# Altium project IEEEBOT_V1I1.PrjPcb (part 1 of 2)
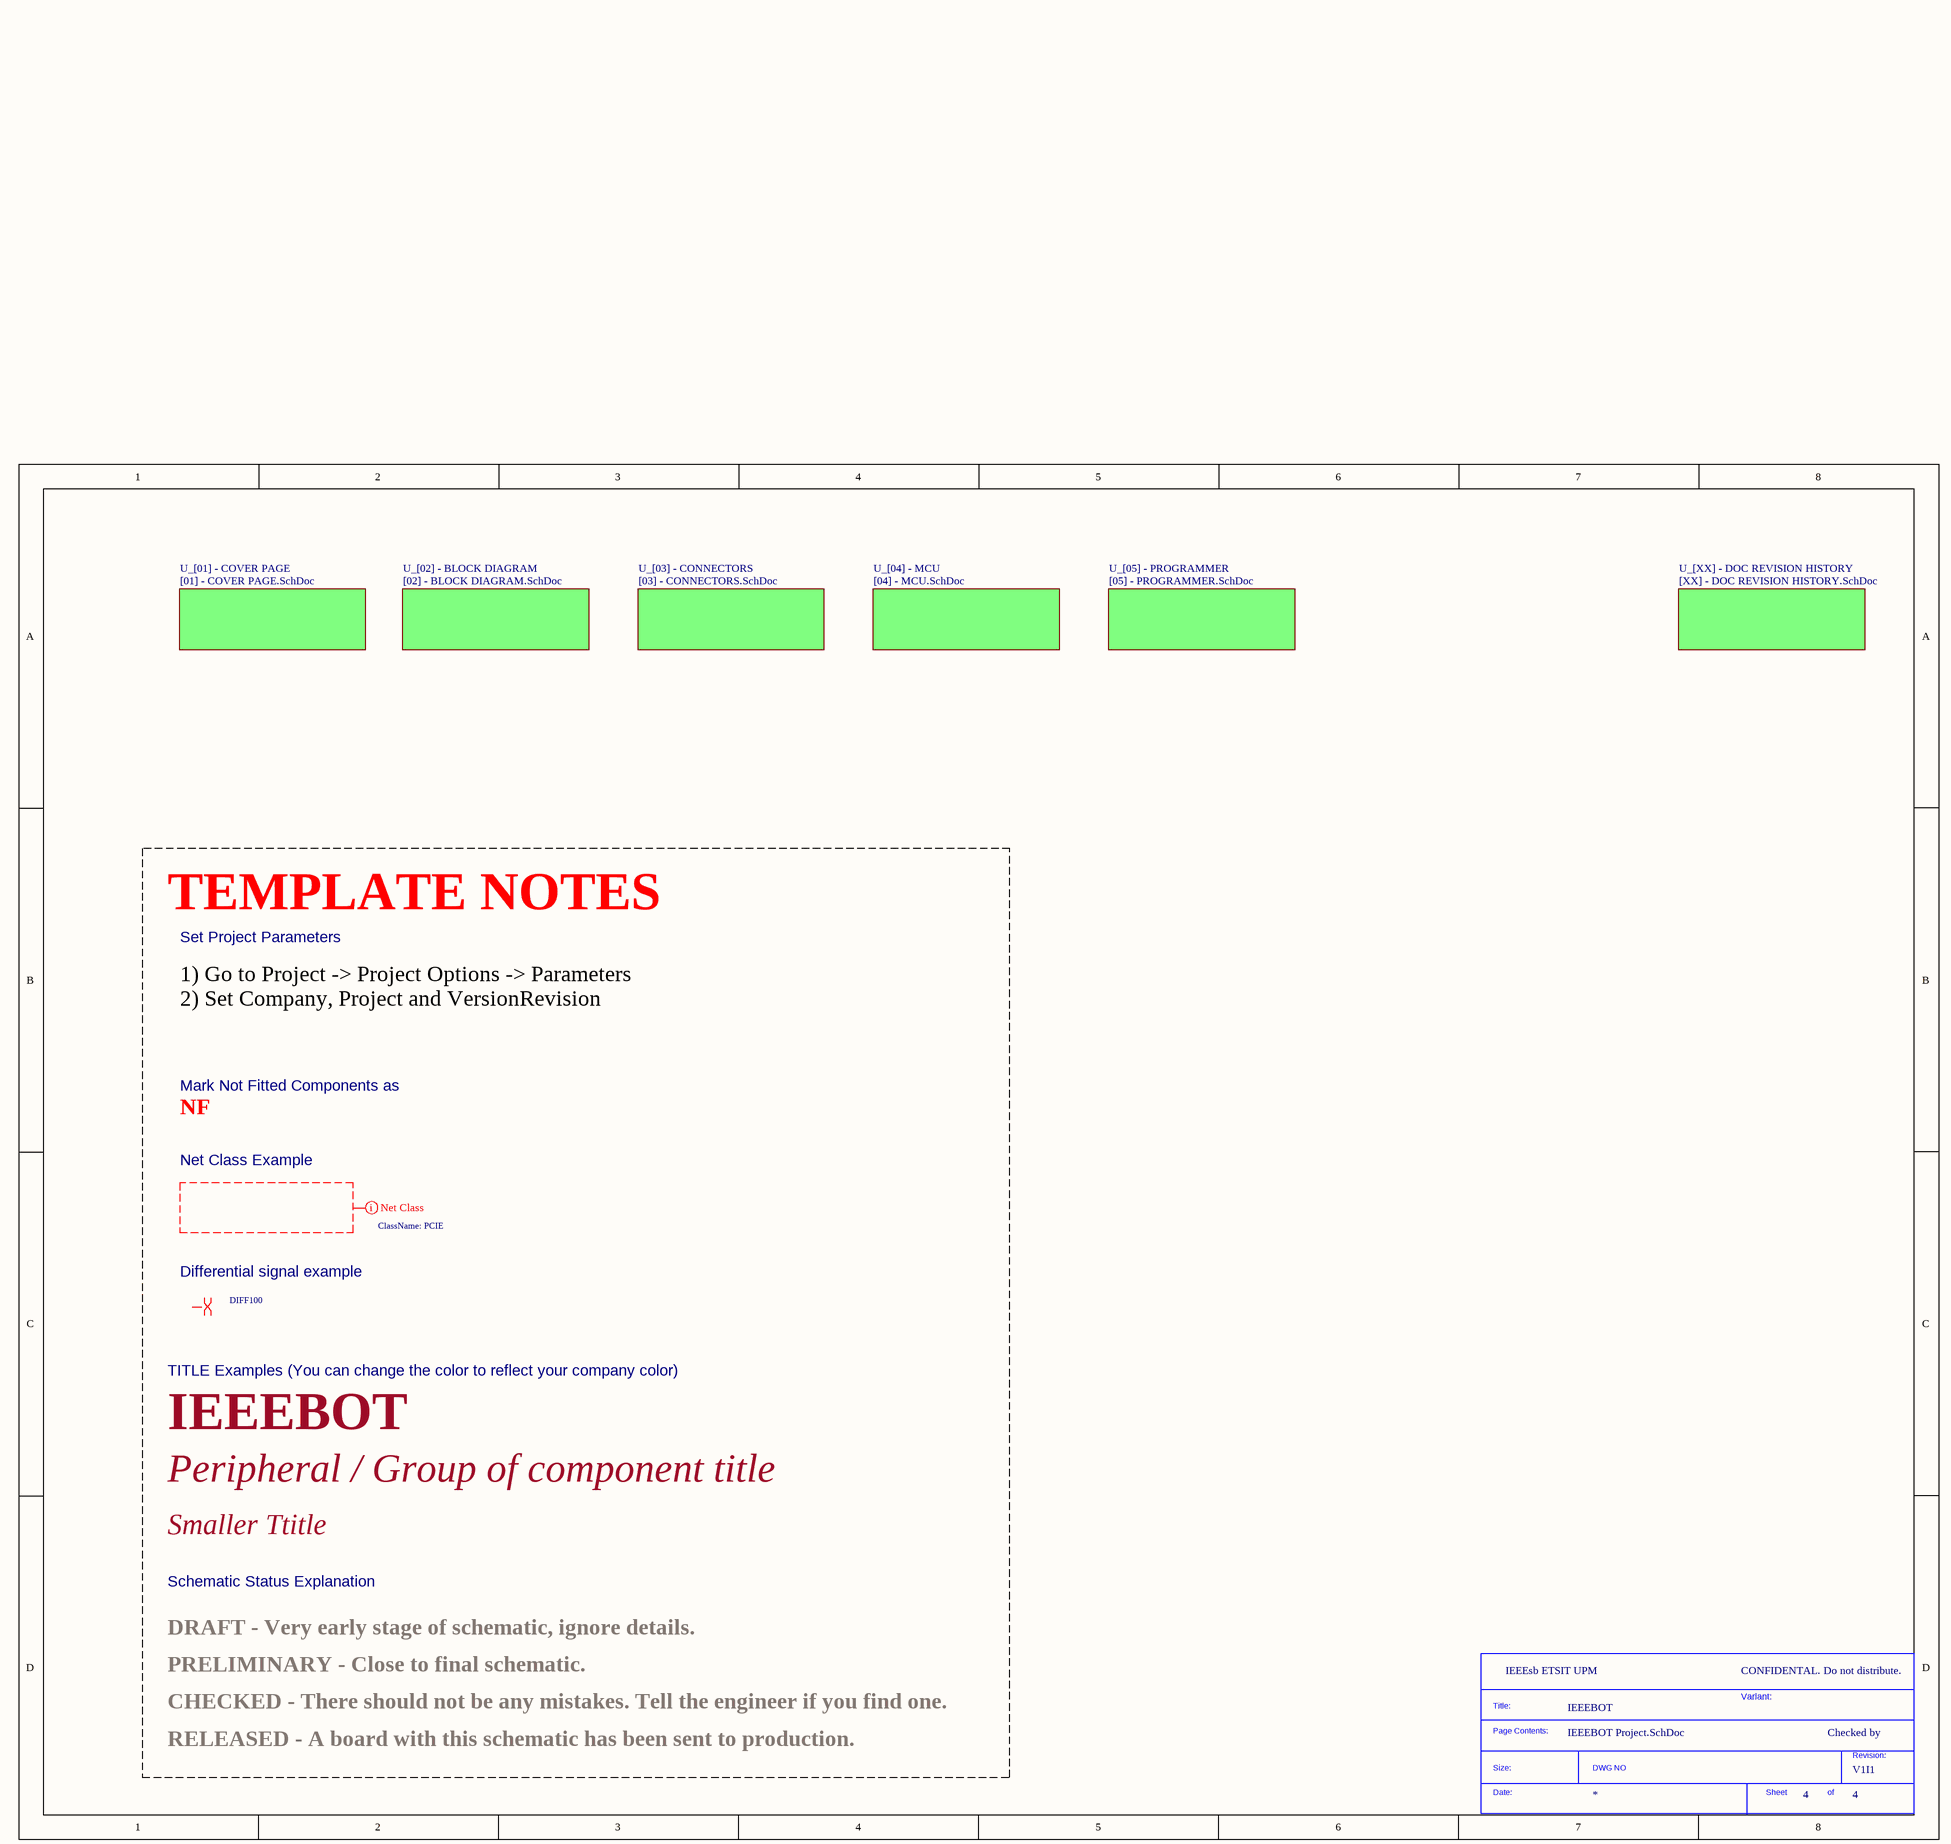
[diagram p0: IEEEBOT Project.SchDoc]
Company: IEEEsb ETSIT UPM; Project: IEEEBOT; VersionRevision: V1I1
4 sheets, 76 parts. Net scope: flat (ports and power ports of the same name join across sheets).
Board file: IEEEBOT_PCB_V1I1.PcbDoc
Sheets:
  IEEEBOT Project.SchDoc
    U_[04] - MCU = [04] - MCU.SchDoc
    U_[05] - PROGRAMMER = [05] - PROGRAMMER.SchDoc
    U_[03] - CONNECTORS = [03] - CONNECTORS.SchDoc

## Sheet IEEEBOT Project.SchDoc
size A3; CompanyName: KDS; Organization: KDS; DocumentNumber: 4; Revision: V1I1; SheetNumber: 4; SheetTotal: 4; PageSetup: Record=PageOptions|CenterHorizontal=True|CenterVertical=True|PrintScale=1.07|XCorrection=1.00|YCorrection=1.00|PrintKind=1|BorderSize=5000000|LeftOffset=0|BottomOffset=0|Orientation=2|PaperLength=1000|PaperWidth=1000|Scale=100|PaperSource=7|PrintQuality=600|MediaType=1|DitherType=10|PaperKind=A3|PrintScaleMode=1; ProjectName: KDS C6A816x Module

### Parts
*  SDTitleBlock  (value not drawn)  (graphical)

### Sub-sheets
U_[01] - COVER PAGE = [01] - COVER PAGE.SchDoc (file not in this document): no entries
U_[02] - BLOCK DIAGRAM = [02] - BLOCK DIAGRAM.SchDoc (file not in this document): no entries
U_[03] - CONNECTORS = [03] - CONNECTORS.SchDoc: no entries
U_[04] - MCU = [04] - MCU.SchDoc: no entries
U_[05] - PROGRAMMER = [05] - PROGRAMMER.SchDoc: no entries
U_[XX] - DOC REVISION HISTORY = [XX] - DOC REVISION HISTORY.SchDoc (file not in this document): no entries

### Layout directives
net class PCIE: (no net found under the mark)
differential pair; net class DIFF100: (no net found under the mark)

### Notes on the sheet
- TEMPLATE NOTES
- Set Project Parameters
- 1) Go to Project -> Project Options -> Parameters
  2) Set Company, Project and VersionRevision
- NF
- Mark Not Fitted Components as
- Net Class Example
- Differential signal example
- TITLE Examples (You can change the color to reflect your company color)
- IEEEBOT
- Peripheral / Group of component title
- Smaller Ttitle
- Schematic Status Explanation
- PRELIMINARY - Close to final schematic.
- DRAFT - Very early stage of schematic, ignore details.
- CONFIDENTAL. Do not distribute.
- CHECKED - There should not be any mistakes. Tell the engineer if you find one.
- Variant:
- Checked by
- RELEASED - A board with this schematic has been sent to production.
- (in symbol SDTitleBlock) Title:; Page Contents:; Revision:; Size:; DWG NO; Date:; Sheet; of

## Sheet [04] - MCU.SchDoc
size A4
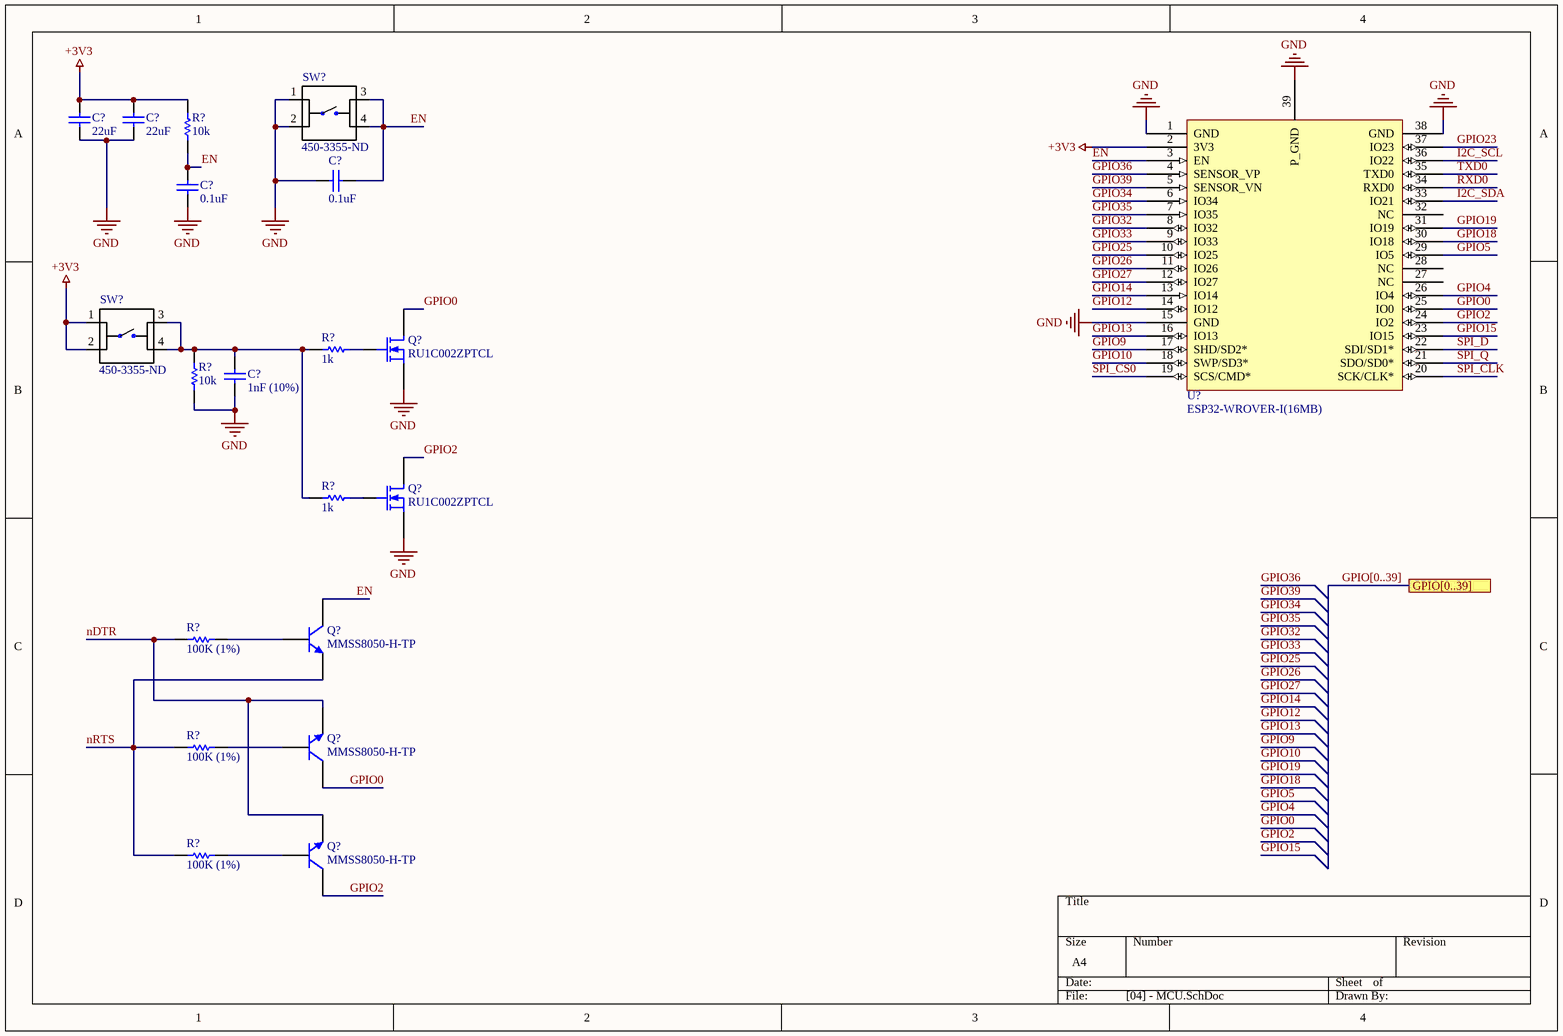
[diagram p1: [04] - MCU.SchDoc]

### Parts
(Parts that share a designator on the sheet are numbered #1, #2 ... from top to bottom, then left to right.)
C?#1  22uF
C?#2  22uF
C?#3  0.1uF
C?#4  0.1uF
C?#5  1nF (10%)
Q?#1  RU1C002ZPTCL
Q?#2  RU1C002ZPTCL
Q?#3  MMSS8050-H-TP
Q?#4  MMSS8050-H-TP
Q?#5  MMSS8050-H-TP
R?#1  10k
R?#2  1k
R?#3  10k
R?#4  1k
R?#5  100K (1%)
R?#6  100K (1%)
R?#7  100K (1%)
SW?#1  Supplier Part Number 1: 450-3355-ND  [*SW_SMD_2-1437565-8_4_4.50_6.00_6.00_5.00]  (hidden comment: 2-1437565-8)
SW?#2  Supplier Part Number 1: 450-3355-ND  [*SW_SMD_2-1437565-8_4_4.50_6.00_6.00_5.00]  (hidden comment: 2-1437565-8)
U?#1  ESP32-WROVER-I(16MB)

### Ports
GPIO[0..39]

### Nets
+3V3: C?#1.2 C?#2.2 R?#1.2 SW?#2.1 SW?#2.2 U?#1.2(3V3)
GND: C?#1.1 C?#2.1 C?#3.1 C?#4.2 C?#5.1 Q?#1.3(S) Q?#2.3(S) R?#3.1 SW?#1.1 SW?#1.2 U?#1.1(GND) U?#1.15(GND) U?#1.38(GND) U?#1.39(P_GND)
EN: C?#3.2 C?#4.1 Q?#3.1(C) R?#1.1 SW?#1.3 SW?#1.4 U?#1.3(EN)
GPIO0: Q?#1.1(D) Q?#4.1(C) U?#1.25(IO0)
GPIO2: Q?#2.1(D) Q?#5.1(C) U?#1.24(IO2)
GPIO4: U?#1.26(IO4)
GPIO5: U?#1.29(IO5)
GPIO9: U?#1.17(SHD/SD2*)
GPIO10: U?#1.18(SWP/SD3*)
GPIO12: U?#1.14(IO12)
GPIO13: U?#1.16(IO13)
GPIO14: U?#1.13(IO14)
GPIO15: U?#1.23(IO15)
GPIO18: U?#1.30(IO18)
GPIO19: U?#1.31(IO19)
GPIO23: U?#1.37(IO23)
GPIO25: U?#1.10(IO25)
GPIO26: U?#1.11(IO26)
GPIO27: U?#1.12(IO27)
GPIO32: U?#1.8(IO32)
GPIO33: U?#1.9(IO33)
GPIO34: U?#1.6(IO34)
GPIO35: U?#1.7(IO35)
GPIO36: U?#1.4(SENSOR_VP)
GPIO39: U?#1.5(SENSOR_VN)
I2C_SCL: U?#1.36(IO22)
I2C_SDA: U?#1.33(IO21)
nDTR: Q?#4.3(E) Q?#5.3(E) R?#5.1
nRTS: Q?#3.3(E) R?#6.1 R?#7.1
RXD0: U?#1.34(RXD0)
SPI_CLK: U?#1.20(SCK/CLK*)
SPI_CS0: U?#1.19(SCS/CMD*)
SPI_D: U?#1.22(SDI/SD1*)
SPI_Q: U?#1.21(SDO/SD0*)
TXD0: U?#1.35(TXD0)
NetC?#5_2: C?#5.2 R?#2.1 R?#3.2 R?#4.1 SW?#2.3 SW?#2.4
NetQ?#1_2: Q?#1.2(G) R?#2.2
NetQ?#2_2: Q?#2.2(G) R?#4.2
NetQ?#3_2: Q?#3.2(B) R?#5.2
NetQ?#4_2: Q?#4.2(B) R?#6.2
NetQ?#5_2: Q?#5.2(B) R?#7.2

Not connected (* = marked no-connect by the designer): U?#1 27(NC) 28(NC) 32(NC)

### Buses and harness runs
bus GPIO[0..39] = port GPIO[0..39]

### Library data of the parts
C?#1 C?#2 = CL21A226KQCLRNC: CAP CER 22UF 6.3V X5R 0805; Manufacturer: Samsung; Tolerance: 10%; Supplier 1: Digi-Key; Manufacturer Part Number: CL21A226KQCLRNC; Stock 1: 975518; RoHS: Yes; Mount: Surface Mount; Case/Package: 0805; Case Code (Metric): 2012; Case Code (Imperial): 0805; Min Operating Temperature: -55°C; Max Operating Temperature: 85°C; Packaging: Tape and Reel; Capacitance: 22uF; Voltage Rating: 6.3V; Length: 0.079inch; Width: 0.049inch; Thickness: 0.037inch; ComponentLink1URL: http://www.samsungsem.com/kr/support/product-search/mlcc/CL21A226KQCLRNC.jsp?src-supplier=Digi-Key; ComponentLink1Description: http://www.samsungsem.com/kr/support/product-search/mlcc/CL21A226KQCLRNC.jsp?src-supplier=Digi-Key; Supplier Part Number 1: 1276-6687-1-ND
C?#3 C?#4 = CL21B104KACNNNC: Cap Ceramic 0.1uF 25V X7R 10% SMD 0805 125C Paper T/R; Manufacturer: Samsung; Capacitance: 100nF; Supplier 1: Digi-Key; Manufacturer Part Number: CL21B104KACNNNC; Stock 1: 319136; RoHS: Yes; Mount: Surface Mount; Case/Package: 0805; Contact Plating: Tin; Case Code (Metric): 2012; Case Code (Imperial): 0805; Min Operating Temperature: -55°C; Max Operating Temperature: 125°C; Package Quantity: 1; Packaging: Tape and Reel; Voltage Rating: 25V; Tolerance: 10%; Dielectric: X7R; Voltage: 25V; Length: 2mm; Height: 0.85mm; Width: 0.049inch; Thickness: 0.037inch; Depth: 1.25mm; Radiation Hardening: No; ComponentLink1URL: https://datasheet.ciiva.com/25801/cl21b104kacnnnc-25801824.pdf?src-supplier=Digi-Key; ComponentLink1Description: https://datasheet.ciiva.com/25801/cl21b104kacnnnc-25801824.pdf?src-supplier=Digi-Key; ComponentLink2URL: https://datasheet.ciiva.com/15216/getdatasheetpartid-355204-15216236.pdf?src-supplier=Verical; ComponentLink2Description: https://datasheet.ciiva.com/15216/getdatasheetpartid-355204-15216236.pdf?src-supplier=Verical; Supplier Part Number 1: 1276-1099-1-ND
C?#5 = CL21B102KBANFNC: Cap Ceramic 0.001uF 50V X7R 10% SMD 0805 125°C Paper T/R; Manufacturer: Samsung; Supplier 1: Digi-Key; Manufacturer Part Number: CL21B102KBANFNC; Stock 1: 199889; Pricing 1: 1 = 0,10000, 10 = 0,05000, 100 = 0,02210, 500 = 0,01576, 1000 = 0,01238 (USD); Mount: Surface Mount; Case/Package: 0805; Case Code (Metric): 2012; Case Code (Imperial): 0805; Contact Plating: Tin; Min Operating Temperature: -55°C; Max Operating Temperature: 125°C; Capacitance: 1nF; Tolerance: 10%; Package Quantity: 1; Packaging: Tape and Reel; Voltage Rating: 50V; Dielectric: X7R; Length: 0.079inch; Height: 0.65mm; Width: 0.049inch; Thickness: 0.03inch; Depth: 1.25mm; Radiation Hardening: No; ComponentLink1URL: https://datasheet.ciiva.com/25780/cl21b102kbanfnc-25780808.pdf?src-supplier=Digi-Key; ComponentLink1Description: https://datasheet.ciiva.com/25780/cl21b102kbanfnc-25780808.pdf?src-supplier=Digi-Key; Supplier Part Number 1: 1276-2424-1-ND
Q?#1 Q?#2 = RU1C002ZPTCL: RU1C002ZP Series 20 V 200 mA 1.2 Ohm Silicon SMT P-Channel Mosfet - UMT-3F; Manufacturer: Rohm; Drain to Source Voltage (Vdss): 20V; Continuous Drain Current (ID): 200mA; Rds On Max: 1.2R; Input Capacitance: 115pF; Max Power Dissipation: 150mW; Supplier 1: Digi-Key; Manufacturer Part Number: RU1C002ZPTCL; Stock 1: 5358; Pricing 1: 1 = 0,24000, 10 = 0,19900, 100 = 0,10570, 500 = 0,06952, 1000 = 0,04728 (USD); Mount: Surface Mount; Case/Package: SC; Number of Pins: 85; Packaging: Tape and Reel; Lead Free: Lead Free; ComponentLink1URL: http://www.mouser.com/ds/2/348/ru1c002zptcl-e-1018306.pdf?src-supplier=Mouser; ComponentLink1Description: http://www.mouser.com/ds/2/348/ru1c002zptcl-e-1018306.pdf?src-supplier=Mouser; ComponentLink2URL: http://www.farnell.com/datasheets/2198004.pdf?src-supplier=Farnell; ComponentLink2Description: http://www.farnell.com/datasheets/2198004.pdf?src-supplier=Farnell; ComponentLink3URL: http://rohmfs.rohm.com/en/products/databook/datasheet/discrete/transistor/mosfet/ru1c002zp.pdf?src-supplier=Avnet; ComponentLink3Description: http://rohmfs.rohm.com/en/products/databook/datasheet/discrete/transistor/mosfet/ru1c002zp.pdf?src-supplier=Avnet; ComponentLink4URL: http://rohmfs.rohm.com/en/techdata_basic/transistor/taping/UMT3_T106_taping.pdf?src-supplier=Digi-Key; ComponentLink4Description: http://rohmfs.rohm.com/en/techdata_basic/transistor/taping/UMT3_T106_taping.pdf?src-supplier=Digi-Key; ComponentLink5URL: http://www.rohm.com/web/global/datasheet/RU1C002ZP/ru1c002zptcl-e?src-supplier=Digi-Key; ComponentLink5Description: http://www.rohm.com/web/global/datasheet/RU1C002ZP/ru1c002zptcl-e?src-supplier=Digi-Key; ComponentLink6URL: http://datasheet.octopart.com/RU1C002ZPTCL-Rohm-datasheet-49196695.pdf?src-supplier=Newark; ComponentLink6Description: http://datasheet.octopart.com/RU1C002ZPTCL-Rohm-datasheet-49196695.pdf?src-supplier=Newark; ComponentLink7URL: http://datasheet.octopart.com/RU1C002ZPTCL-Rohm-datasheet-79607677.pdf?src-supplier=Future+Electronics; ComponentLink7Description: http://datasheet.octopart.com/RU1C002ZPTCL-Rohm-datasheet-79607677.pdf?src-supplier=Future+Electronics; Supplier Part Number 1: RU1C002ZPTCLCT-ND
Q?#3-Q?#5 = MMSS8050-H-TP: MMSS8050-H Series 25 V 1.5 A NPN Silicon Plastic-Encapsulate Transistor-SOT-23; Manufacturer: MCC; hFE Min: 120; Max Power Dissipation: 625mW; Collector Emitter Voltage (VCEO): 500mV; Collector Base Voltage (VCBO): 40V; Emitter Base Voltage (VEBO): 5V; Max Collector Current: 1.5A; Collector Emitter Breakdown Voltage: 25V; Transition Frequency: 100MHz; Element Configuration: Single; Supplier 1: Digi-Key; Manufacturer Part Number: MMSS8050-H-TP; Stock 1: 37298; Pricing 1: 1 = 0,21000, 10 = 0,19000, 25 = 0,17280, 100 = 0,12460, 250 = 0,07336, 500 = 0,06090, 1000 = 0,04152 (USD); Mount: Surface Mount; Case/Package: SOT-23; Number of Pins: 3; Min Operating Temperature: -55°C; Max Operating Temperature: 150°C; Packaging: Tape and Reel; Package Quantity: 3000; Polarity: NPN; Collector Emitter Saturation Voltage: 500mV; Max Breakdown Voltage: 25V; Gain Bandwidth Product: 100MHz; Lead Free: Lead Free; ComponentLink1URL: https://datasheet.ciiva.com/16291/mmss8050-255048-16291447.pdf?src-supplier=Mouser; ComponentLink1Description: https://datasheet.ciiva.com/16291/mmss8050-255048-16291447.pdf?src-supplier=Mouser; ComponentLink2URL: https://datasheet.ciiva.com/972/mmss8050sot-23-972893.pdf?src-supplier=Digi-Key; ComponentLink2Description: https://datasheet.ciiva.com/972/mmss8050sot-23-972893.pdf?src-supplier=Digi-Key; ComponentLink3URL: https://datasheet.ciiva.com/972/mmss8050sot-23-972894.pdf?src-supplier=Digi-Key; ComponentLink3Description: https://datasheet.ciiva.com/972/mmss8050sot-23-972894.pdf?src-supplier=Digi-Key; ComponentLink4URL: https://datasheet.ciiva.com/972/mmss8050sot-23-972895.pdf?src-supplier=Digi-Key; ComponentLink4Description: https://datasheet.ciiva.com/972/mmss8050sot-23-972895.pdf?src-supplier=Digi-Key; ComponentLink5URL: http://datasheet.octopart.com/MMSS8050-H-TP-MCC-datasheet-27626576.pdf?src-supplier=Future+Electronics; ComponentLink5Description: http://datasheet.octopart.com/MMSS8050-H-TP-MCC-datasheet-27626576.pdf?src-supplier=Future+Electronics; Supplier Part Number 1: MMSS8050-H-TPMSCT-ND
R?#1 R?#3 = RC2012F103CS: Res Thick Film 0805 10K Ohm 1% 0.125W(1/8W) ±100ppm/C Molded SMD T/R; Manufacturer: Samsung; Resistance: 10kR; Power Rating: 125mW; Temperature Coefficient: 100ppm/°C; Supplier 1: Digi-Key; Manufacturer Part Number: RC2012F103CS; Stock 1: 565008; RoHS: Yes; Case/Package: 0805; Case Code (Metric): 2012; Case Code (Imperial): 0805; Contact Plating: Tin; Min Operating Temperature: -55°C; Max Operating Temperature: 155°C; Tolerance: 1%; Packaging: Tape and Reel; Composition: Thick Film; Package Quantity: 1; Number of Terminations: 2; Military Standard: Not; Max Power Dissipation: 125mW; Features: Moisture Resistant; Length: 0.079inch; Height: 0.024inch; Width: 0.049inch; Depth: 1.25mm; Radiation Hardening: No; ComponentLink1URL: http://components.arrow.com/part/dataview/0323_04212069?src-supplier=Arrow+Europe; ComponentLink1Description: http://components.arrow.com/part/dataview/0323_04212069?src-supplier=Arrow+Europe; ComponentLink2URL: http://www1.futureelectronics.com/doc/SAMSUNG/RCSERIES.pdf?src-supplier=Future+Electronics; ComponentLink2Description: http://www1.futureelectronics.com/doc/SAMSUNG/RCSERIES.pdf?src-supplier=Future+Electronics; ComponentLink3URL: https://sem.samsung.co.kr/servlet/DownloadServlet?dir=product/en/A070002&num=&fileName=Resistor-Precision1.pdf&src-supplier=Avnet; ComponentLink3Description: https://sem.samsung.co.kr/servlet/DownloadServlet?dir=product/en/A070002&num=&fileName=Resistor-Precision1.pdf&src-supplier=Avnet; ComponentLink4URL: http://www.samsungsem.com/kr/support/product-search/chip-resistor/RC2012F103CS.jsp?src-supplier=Digi-Key; ComponentLink4Description: http://www.samsungsem.com/kr/support/product-search/chip-resistor/RC2012F103CS.jsp?src-supplier=Digi-Key; ComponentLink5URL: https://sem.samsung.co.kr/servlet/DownloadServlet?dir=product/en/A070002&num=&fileName=Resistor-Precision1.pdf&src-supplier=Avnet+Europe; ComponentLink5Description: https://sem.samsung.co.kr/servlet/DownloadServlet?dir=product/en/A070002&num=&fileName=Resistor-Precision1.pdf&src-supplier=Avnet+Europe; ComponentLink6URL: http://components.arrow.com/part/dataview/51841145S9370186N4139?src-supplier=Arrow; ComponentLink6Description: http://components.arrow.com/part/dataview/51841145S9370186N4139?src-supplier=Arrow; Supplier Part Number 1: 1276-5332-1-ND
R?#2 R?#4 = RC2012F102CS: Res Thick Film 0805 1K Ohm 1% 1/8W ±100ppm/°C Molded SMD SMD T/R; Manufacturer: Samsung; Resistance: 1kR; Max Power Dissipation: 125mW; Voltage Rating (DC): 150V; Supplier 1: Digi-Key; Manufacturer Part Number: RC2012F102CS; Stock 1: 37707; Pricing 1: 1 = 0,10000, 10 = 0,05600, 100 = 0,02290, 1000 = 0,01030, 2500 = 0,00894 (USD); Case/Package: 0805; Case Code (Metric): 2012; Case Code (Imperial): 0805; Contact Plating: Tin; Min Operating Temperature: -55°C; Max Operating Temperature: 155°C; Tolerance: 1%; Packaging: Tape and Reel; Composition: Thick Film; Number of Terminations: 2; Military Standard: Not; Temperature Coefficient: 100ppm/°C; Features: Moisture Resistant; Length: 0.079inch; Height: 0.024inch; Width: 0.049inch; Depth: 1.25mm; Radiation Hardening: No; Lead Free: Lead Free; ComponentLink1URL: https://datasheet.ciiva.com/26151/chip-resistor-150112-1-26151882.pdf?src-supplier=Digi-Key; ComponentLink1Description: https://datasheet.ciiva.com/26151/chip-resistor-150112-1-26151882.pdf?src-supplier=Digi-Key; ComponentLink2URL: https://datasheet.ciiva.com/26151/chip-resistor-150112-1-26151870.pdf?src-supplier=Digi-Key; ComponentLink2Description: https://datasheet.ciiva.com/26151/chip-resistor-150112-1-26151870.pdf?src-supplier=Digi-Key; ComponentLink3URL: http://datasheet.octopart.com/RC2012F102CS-Samsung-datasheet-41960856.pdf; ComponentLink3Description: http://datasheet.octopart.com/RC2012F102CS-Samsung-datasheet-41960856.pdf; Supplier Part Number 1: 1276-5272-1-ND
R?#5-R?#7 = RC2012F104CS: Res Thick Film 0805 100K Ohm 1% 0.125W(1/8W) ±100ppm/C Pad SMD T/R; Manufacturer: Samsung; Resistance: 100kR; Max Power Dissipation: 125mW; Temperature Coefficient: 100ppm/°C; Voltage Rating (DC): 150V; Supplier 1: Digi-Key; Manufacturer Part Number: RC2012F104CS; Stock 1: 71115; Pricing 1: 1 = 0,10000, 10 = 0,05600, 100 = 0,02290, 1000 = 0,01030, 2500 = 0,00894 (USD); Case/Package: 0805; Case Code (Metric): 2012; Case Code (Imperial): 0805; Contact Plating: Tin; Min Operating Temperature: -55°C; Max Operating Temperature: 155°C; Packaging: Tape and Reel; Tolerance: 1%; Composition: Thick Film; Number of Terminations: 2; Military Standard: Not; Features: Moisture Resistant; Length: 0.079inch; Height: 0.024inch; Width: 0.049inch; Depth: 1.25mm; Radiation Hardening: No; Lead Free: Lead Free; ComponentLink1URL: https://datasheet.ciiva.com/26154/chip-resistor-150112-1-26154663.pdf?src-supplier=Digi-Key; ComponentLink1Description: https://datasheet.ciiva.com/26154/chip-resistor-150112-1-26154663.pdf?src-supplier=Digi-Key; ComponentLink2URL: https://datasheet.ciiva.com/26154/chip-resistor-150112-1-26154635.pdf?src-supplier=Digi-Key; ComponentLink2Description: https://datasheet.ciiva.com/26154/chip-resistor-150112-1-26154635.pdf?src-supplier=Digi-Key; ComponentLink3URL: https://datasheet.ciiva.com/26154/chip-resistor-150112-1-26154649.pdf?src-supplier=Digi-Key; ComponentLink3Description: https://datasheet.ciiva.com/26154/chip-resistor-150112-1-26154649.pdf?src-supplier=Digi-Key; ComponentLink4URL: http://datasheet.octopart.com/RC2012F104CS-Samsung-Electro-Mechanics-datasheet-128083940.pdf?src-supplier=Future+Electronics; ComponentLink4Description: http://datasheet.octopart.com/RC2012F104CS-Samsung-Electro-Mechanics-datasheet-128083940.pdf?src-supplier=Future+Electronics; ComponentLink5URL: http://datasheet.octopart.com/RC2012F104CS-Samsung-Electro-Mechanics-datasheet-41960856.pdf; ComponentLink5Description: http://datasheet.octopart.com/RC2012F104CS-Samsung-Electro-Mechanics-datasheet-41960856.pdf; ComponentLink6URL: http://datasheet.octopart.com/RC2012F104CS-Samsung-datasheet-22122684.pdf?src-supplier=Future+Electronics; ComponentLink6Description: http://datasheet.octopart.com/RC2012F104CS-Samsung-datasheet-22122684.pdf?src-supplier=Future+Electronics; Supplier Part Number 1: 1276-3512-1-ND
SW?#1 SW?#2 = 2-1437565-8: Switch Tactile OFF _ON_ SPST Round Button Gull Wing 0.05A 24VDC 1VA 9.18N SMD Bulk; MF: TE Connectivity; Operating Force: 260gf; Max Current Rating: 50mA; Voltage Rating (DC): 24V; Illumination Type: Non-Illuminated; Connector Type: SMD/SMT; Switch Function: Off-Mom; Actuator Type: Standard; Availability: Unavailable; Price: None; Package: None; TE_purchase_URL: https://www.te.com/usa-en/product-2-1437565-8.html?te_bu=Cor&te_type=disp&te_campaign=seda_glo_cor-seda-global-disp-prtnr-fy19-seda-model-bom-cta_sma-317_1&elqCampaignId=32493; SnapEDA_Link: https://www.snapeda.com/parts/2-1437565-8/TE%20Connectivity/view-part/?ref=snap; MP: 2-1437565-8; Value: *; Supplier 1: Digi-Key; Manufacturer: TE Connectivity; Manufacturer Part Number: 2-1437565-8; Stock 1: 18898; Pricing 1: 1 = 0,20000, 10 = 0,19500, 25 = 0,18840, 50 = 0,18160, 100 = 0,17150, 250 = 0,16140, 500 = 0,15468, 1000 = 0,11769, 5000 = 0,09751 (USD); Mount: Surface Mount; Case/Package: SMD/SMT; Contact Material: Copper Alloy; Contact Plating: Silver; Material: Polyamide; Min Operating Temperature: -20°C; Max Operating Temperature: 85°C; Throw Configuration: SPST; Packaging: Bulk; Current Rating: 50mA; Max Voltage Rating (DC): 24V; Package Quantity: 750; Termination: Gull Wing; Orientation: Straight; Length: 6mm; Height: 4.3mm; Depth: 10mm; Radiation Hardening: No; ComponentLink1URL: https://datasheet.ciiva.com/16995/0900766b80fa5b0a-16995515.pdf?src-supplier=Allied+Electronics; ComponentLink1Description: https://datasheet.ciiva.com/16995/0900766b80fa5b0a-16995515.pdf?src-supplier=Allied+Electronics; ComponentLink2URL: https://datasheet.ciiva.com/8165/eng-cs-1654270-2-0807-8165018.pdf?src-supplier=Avnet; ComponentLink2Description: https://datasheet.ciiva.com/8165/eng-cs-1654270-2-0807-8165018.pdf?src-supplier=Avnet; ComponentLink3URL: https://datasheet.ciiva.com/16535/eng-cs-1654270-2-0807-16535247.pdf?src-supplier=Avnet+Europe; ComponentLink3Description: https://datasheet.ciiva.com/16535/eng-cs-1654270-2-0807-16535247.pdf?src-supplier=Avnet+Europe; ComponentLink4URL: http://datasheet.octopart.com/FSM2JSMAA-Tyco-Electronics-datasheet-11083199.pdf?src-supplier=TE+Connectivity; ComponentLink4Description: http://datasheet.octopart.com/FSM2JSMAA-Tyco-Electronics-datasheet-11083199.pdf?src-supplier=TE+Connectivity; ComponentLink5URL: http://datasheet.octopart.com/FSM2JSMAA-Alcoswitch-datasheet-10294628.pdf?src-supplier=Allied+Electronics; ComponentLink5Description: http://datasheet.octopart.com/FSM2JSMAA-Alcoswitch-datasheet-10294628.pdf?src-supplier=Allied+Electronics; ComponentLink6URL: http://datasheet.octopart.com/FSM2JSMAA-TE-Connectivity-datasheet-62056516.pdf?src-supplier=TE+Connectivity; ComponentLink6Description: http://datasheet.octopart.com/FSM2JSMAA-TE-Connectivity-datasheet-62056516.pdf?src-supplier=TE+Connectivity; ComponentLink7URL: http://sigma.octopart.com/11868940/technical_drawing/Alcoswitch-FSM2JSMAA.pdf?src-supplier=TE+Connectivity; ComponentLink7Description: http://sigma.octopart.com/11868940/technical_drawing/Alcoswitch-FSM2JSMAA.pdf?src-supplier=TE+Connectivity; ComponentLink8URL: http://datasheet.octopart.com/2-1437565-8-Tyco-Electronics-datasheet-160371.pdf?src-supplier=Arrow; ComponentLink8Description: http://datasheet.octopart.com/2-1437565-8-Tyco-Electronics-datasheet-160371.pdf?src-supplier=Arrow
U?#1 = ESP32-WROVER-I(16MB): WIFI MODULE 128MBITS SPI FLASH; Manufacturer: Espressif Systems; Revised: False; Supplier 1: Digi-Key; Manufacturer Part Number: ESP32-WROVER-I(16MB); Stock 1: 5577; RoHS: No; ComponentLink1URL: https://www.espressif.com/sites/default/files/documentation/esp32-wrover_datasheet_en.pdf?src-supplier=Digi-Key; ComponentLink1Description: https://www.espressif.com/sites/default/files/documentation/esp32-wrover_datasheet_en.pdf?src-supplier=Digi-Key; ComponentLink2URL: https://www.espressif.com/sites/default/files/documentation/esp32_datasheet_en.pdf?src-supplier=Digi-Key; ComponentLink2Description: https://www.espressif.com/sites/default/files/documentation/esp32_datasheet_en.pdf?src-supplier=Digi-Key; Supplier Part Number 1: 1904-1017-1-ND